# Altium schematic sheet Sitara_Power.SchDoc
size A3; SheetNumber: 4; SheetTotal: 10
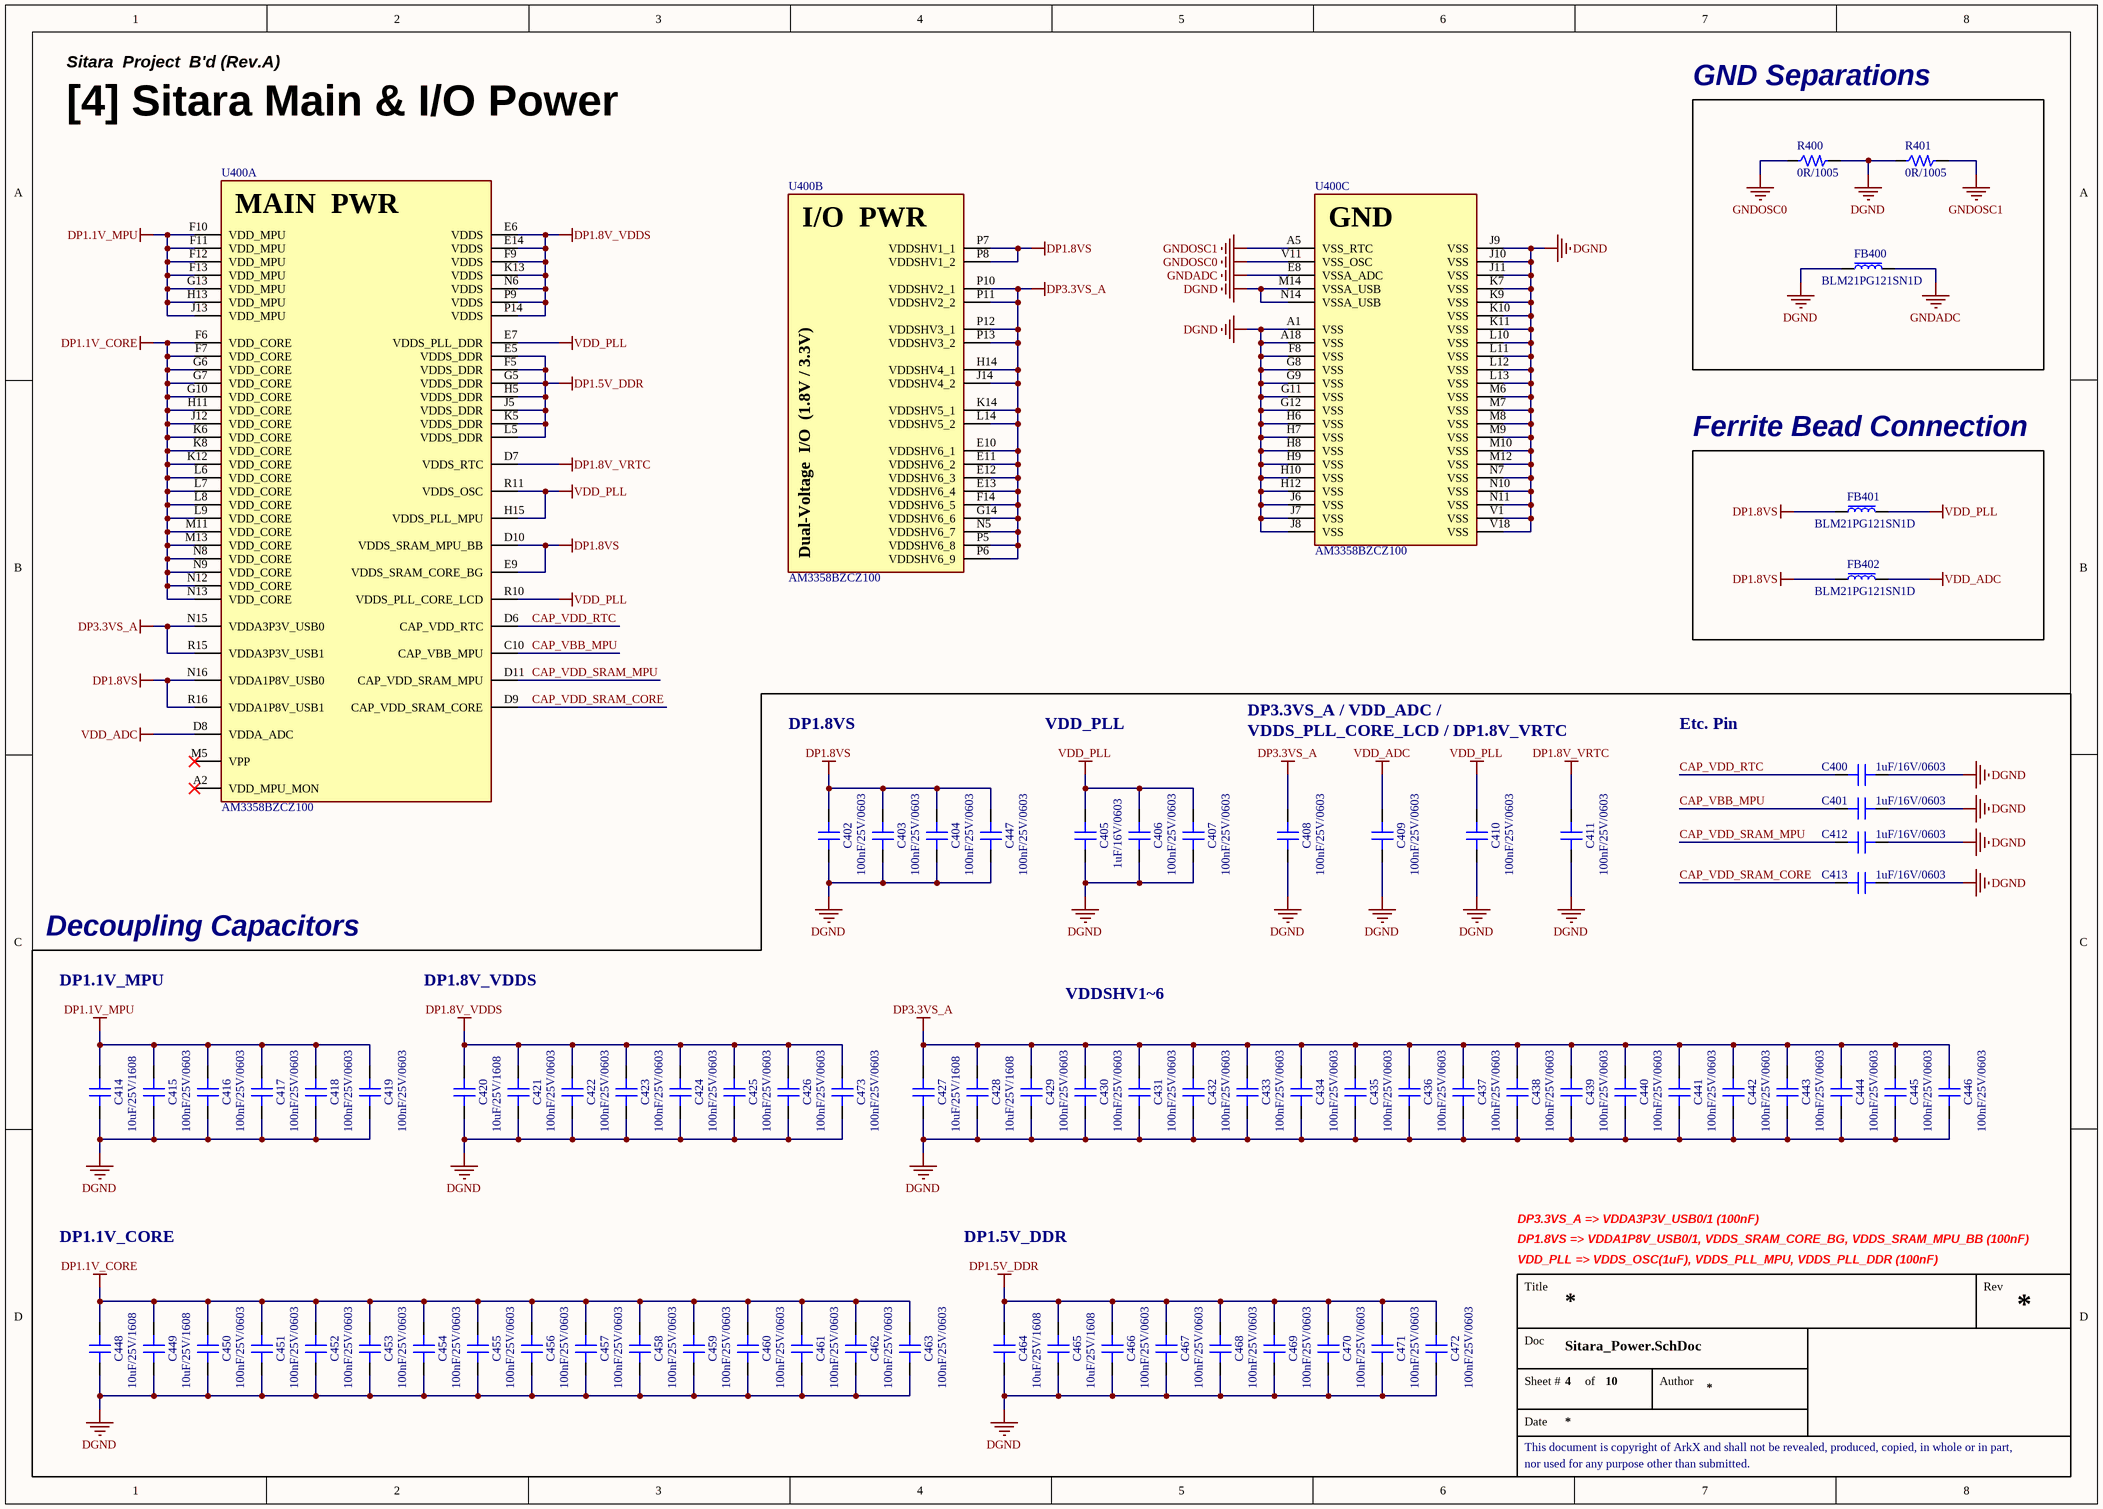
[diagram p0: Sitara_Power.SchDoc]

## Parts
C400  1uF/16V/0603  [CAP 0603 (0201_INCH)]
C401  1uF/16V/0603  [CAP 0603 (0201_INCH)]
C402  100nF/25V/0603  [CAP 0603 (0201_INCH)]
C403  100nF/25V/0603  [CAP 0603 (0201_INCH)]
C404  100nF/25V/0603  [CAP 0603 (0201_INCH)]
C405  1uF/16V/0603  [CAP 0603 (0201_INCH)]
C406  100nF/25V/0603  [CAP 0603 (0201_INCH)]
C407  100nF/25V/0603  [CAP 0603 (0201_INCH)]
C408  100nF/25V/0603  [CAP 0603 (0201_INCH)]
C409  100nF/25V/0603  [CAP 0603 (0201_INCH)]
C410  100nF/25V/0603  [CAP 0603 (0201_INCH)]
C411  100nF/25V/0603  [CAP 0603 (0201_INCH)]
C412  1uF/16V/0603  [CAP 0603 (0201_INCH)]
C413  1uF/16V/0603  [CAP 0603 (0201_INCH)]
C414  10uF/25V/1608  [CAP 1608 (0603_INCH)]
C415  100nF/25V/0603  [CAP 0603 (0201_INCH)]
C416  100nF/25V/0603  [CAP 0603 (0201_INCH)]
C417  100nF/25V/0603  [CAP 0603 (0201_INCH)]
C418  100nF/25V/0603  [CAP 0603 (0201_INCH)]
C419  100nF/25V/0603  [CAP 0603 (0201_INCH)]
C420  10uF/25V/1608  [CAP 1608 (0603_INCH)]
C421  100nF/25V/0603  [CAP 0603 (0201_INCH)]
C422  100nF/25V/0603  [CAP 0603 (0201_INCH)]
C423  100nF/25V/0603  [CAP 0603 (0201_INCH)]
C424  100nF/25V/0603  [CAP 0603 (0201_INCH)]
C425  100nF/25V/0603  [CAP 0603 (0201_INCH)]
C426  100nF/25V/0603  [CAP 0603 (0201_INCH)]
C427  10uF/25V/1608  [CAP 1608 (0603_INCH)]
C428  10uF/25V/1608  [CAP 1608 (0603_INCH)]
C429  100nF/25V/0603  [CAP 0603 (0201_INCH)]
C430  100nF/25V/0603  [CAP 0603 (0201_INCH)]
C431  100nF/25V/0603  [CAP 0603 (0201_INCH)]
C432  100nF/25V/0603  [CAP 0603 (0201_INCH)]
C433  100nF/25V/0603  [CAP 0603 (0201_INCH)]
C434  100nF/25V/0603  [CAP 0603 (0201_INCH)]
C435  100nF/25V/0603  [CAP 0603 (0201_INCH)]
C436  100nF/25V/0603  [CAP 0603 (0201_INCH)]
C437  100nF/25V/0603  [CAP 0603 (0201_INCH)]
C438  100nF/25V/0603  [CAP 0603 (0201_INCH)]
C439  100nF/25V/0603  [CAP 0603 (0201_INCH)]
C440  100nF/25V/0603  [CAP 0603 (0201_INCH)]
C441  100nF/25V/0603  [CAP 0603 (0201_INCH)]
C442  100nF/25V/0603  [CAP 0603 (0201_INCH)]
C443  100nF/25V/0603  [CAP 0603 (0201_INCH)]
C444  100nF/25V/0603  [CAP 0603 (0201_INCH)]
C445  100nF/25V/0603  [CAP 0603 (0201_INCH)]
C446  100nF/25V/0603  [CAP 0603 (0201_INCH)]
C447  100nF/25V/0603  [CAP 0603 (0201_INCH)]
C448  10uF/25V/1608  [CAP 1608 (0603_INCH)]
C449  10uF/25V/1608  [CAP 1608 (0603_INCH)]
C450  100nF/25V/0603  [CAP 0603 (0201_INCH)]
C451  100nF/25V/0603  [CAP 0603 (0201_INCH)]
C452  100nF/25V/0603  [CAP 0603 (0201_INCH)]
C453  100nF/25V/0603  [CAP 0603 (0201_INCH)]
C454  100nF/25V/0603  [CAP 0603 (0201_INCH)]
C455  100nF/25V/0603  [CAP 0603 (0201_INCH)]
C456  100nF/25V/0603  [CAP 0603 (0201_INCH)]
C457  100nF/25V/0603  [CAP 0603 (0201_INCH)]
C458  100nF/25V/0603  [CAP 0603 (0201_INCH)]
C459  100nF/25V/0603  [CAP 0603 (0201_INCH)]
C460  100nF/25V/0603  [CAP 0603 (0201_INCH)]
C461  100nF/25V/0603  [CAP 0603 (0201_INCH)]
C462  100nF/25V/0603  [CAP 0603 (0201_INCH)]
C463  100nF/25V/0603  [CAP 0603 (0201_INCH)]
C464  10uF/25V/1608  [CAP 1608 (0603_INCH)]
C465  10uF/25V/1608  [CAP 1608 (0603_INCH)]
C466  100nF/25V/0603  [CAP 0603 (0201_INCH)]
C467  100nF/25V/0603  [CAP 0603 (0201_INCH)]
C468  100nF/25V/0603  [CAP 0603 (0201_INCH)]
C469  100nF/25V/0603  [CAP 0603 (0201_INCH)]
C470  100nF/25V/0603  [CAP 0603 (0201_INCH)]
C471  100nF/25V/0603  [CAP 0603 (0201_INCH)]
C472  100nF/25V/0603  [CAP 0603 (0201_INCH)]
C473  100nF/25V/0603  [CAP 0603 (0201_INCH)]
FB400  BLM21PG121SN1D  [FB 2012 (0805_inch)]
FB401  BLM21PG121SN1D  [FB 2012 (0805_inch)]
FB402  BLM21PG121SN1D  [FB 2012 (0805_inch)]
R400  0R/1005  [RES 1005 (0402_inch)]
R401  0R/1005  [RES 1005 (0402_inch)]
U400  AM3358BZCZ100  [IC_SOC_AM3358BZCZ100]  (parts A,B,C of 8)

## Blocks framed on the sheet
GND Separations: FB400 R400 R401
Ferrite Bead Connection: FB401 FB402

## Nets
DGND: C400.2 C401.2 C402.1 C403.1 C404.1 C405.1 C406.1 C407.1 C408.1 C409.1 C410.1 C411.1 C412.2 C413.2 C414.1 C415.1 C416.1 C417.1 C418.1 C419.1 C420.1 C421.1 C422.1 C423.1 C424.1 C425.1 C426.1 C427.1 C428.1 C429.1 C430.1 C431.1 C432.1 C433.1 C434.1 C435.1 C436.1 C437.1 C438.1 C439.1 C440.1 C441.1 C442.1 C443.1 C444.1 C445.1 C446.1 C447.1 C448.1 C449.1 C450.1 C451.1 C452.1 C453.1 C454.1 C455.1 C456.1 C457.1 C458.1 C459.1 C460.1 C461.1 C462.1 C463.1 C464.1 C465.1 C466.1 C467.1 C468.1 C469.1 C470.1 C471.1 C472.1 C473.1 FB400.1 R400.2 R401.1 U400.A1(VSS) U400.A18(VSS) U400.F8(VSS) U400.G8(VSS) U400.G9(VSS) U400.G11(VSS) U400.G12(VSS) U400.H6(VSS) U400.H7(VSS) U400.H8(VSS) U400.H9(VSS) U400.H10(VSS) U400.H12(VSS) U400.J6(VSS) U400.J7(VSS) U400.J8(VSS) U400.J9(VSS) U400.J10(VSS) U400.J11(VSS) U400.K7(VSS) U400.K9(VSS) U400.K10(VSS) U400.K11(VSS) U400.L10(VSS) U400.L11(VSS) U400.L12(VSS) U400.L13(VSS) U400.M6(VSS) U400.M7(VSS) U400.M8(VSS) U400.M9(VSS) U400.M10(VSS) U400.M12(VSS) U400.M14(VSSA_USB) U400.N7(VSS) U400.N10(VSS) U400.N11(VSS) U400.N14(VSSA_USB) U400.V1(VSS) U400.V18(VSS)
DP1.1V_CORE: C448.2 C449.2 C450.2 C451.2 C452.2 C453.2 C454.2 C455.2 C456.2 C457.2 C458.2 C459.2 C460.2 C461.2 C462.2 C463.2 U400.F6(VDD_CORE) U400.F7(VDD_CORE) U400.G6(VDD_CORE) U400.G7(VDD_CORE) U400.G10(VDD_CORE) U400.H11(VDD_CORE) U400.J12(VDD_CORE) U400.K6(VDD_CORE) U400.K8(VDD_CORE) U400.K12(VDD_CORE) U400.L6(VDD_CORE) U400.L7(VDD_CORE) U400.L8(VDD_CORE) U400.L9(VDD_CORE) U400.M11(VDD_CORE) U400.M13(VDD_CORE) U400.N8(VDD_CORE) U400.N9(VDD_CORE) U400.N12(VDD_CORE) U400.N13(VDD_CORE)
DP1.1V_MPU: C414.2 C415.2 C416.2 C417.2 C418.2 C419.2 U400.F10(VDD_MPU) U400.F11(VDD_MPU) U400.F12(VDD_MPU) U400.F13(VDD_MPU) U400.G13(VDD_MPU) U400.H13(VDD_MPU) U400.J13(VDD_MPU)
DP1.5V_DDR: C464.2 C465.2 C466.2 C467.2 C468.2 C469.2 C470.2 C471.2 C472.2 U400.E5(VDDS_DDR) U400.F5(VDDS_DDR) U400.G5(VDDS_DDR) U400.H5(VDDS_DDR) U400.J5(VDDS_DDR) U400.K5(VDDS_DDR) U400.L5(VDDS_DDR)
DP1.8V_VDDS: C420.2 C421.2 C422.2 C423.2 C424.2 C425.2 C426.2 C473.2 U400.E6(VDDS) U400.E14(VDDS) U400.F9(VDDS) U400.K13(VDDS) U400.N6(VDDS) U400.P9(VDDS) U400.P14(VDDS)
DP1.8V_VRTC: C411.2 U400.D7(VDDS_RTC)
DP1.8VS: C402.2 C403.2 C404.2 C447.2 FB401.1 FB402.1 U400.D10(VDDS_SRAM_MPU_BB) U400.E9(VDDS_SRAM_CORE_BG) U400.N16(VDDA1P8V_USB0) U400.P7(VDDSHV1_1) U400.P8(VDDSHV1_2) U400.R16(VDDA1P8V_USB1)
DP3.3VS_A: C408.2 C427.2 C428.2 C429.2 C430.2 C431.2 C432.2 C433.2 C434.2 C435.2 C436.2 C437.2 C438.2 C439.2 C440.2 C441.2 C442.2 C443.2 C444.2 C445.2 C446.2 U400.E10(VDDSHV6_1) U400.E11(VDDSHV6_2) U400.E12(VDDSHV6_3) U400.E13(VDDSHV6_4) U400.F14(VDDSHV6_5) U400.G14(VDDSHV6_6) U400.H14(VDDSHV4_1) U400.J14(VDDSHV4_2) U400.K14(VDDSHV5_1) U400.L14(VDDSHV5_2) U400.N5(VDDSHV6_7) U400.N15(VDDA3P3V_USB0) U400.P5(VDDSHV6_8) U400.P6(VDDSHV6_9) U400.P10(VDDSHV2_1) U400.P11(VDDSHV2_2) U400.P12(VDDSHV3_1) U400.P13(VDDSHV3_2) U400.R15(VDDA3P3V_USB1)
GNDADC: FB400.2 U400.E8(VSSA_ADC)
GNDOSC0: R400.1 U400.V11(VSS_OSC)
GNDOSC1: R401.2 U400.A5(VSS_RTC)
VDD_ADC: C409.2 FB402.2 U400.D8(VDDA_ADC)
VDD_PLL: C405.2 C406.2 C407.2 C410.2 FB401.2 U400.E7(VDDS_PLL_DDR) U400.H15(VDDS_PLL_MPU) U400.R10(VDDS_PLL_CORE_LCD) U400.R11(VDDS_OSC)
CAP_VBB_MPU: C401.1 U400.C10(CAP_VBB_MPU)
CAP_VDD_RTC: C400.1 U400.D6(CAP_VDD_RTC)
CAP_VDD_SRAM_CORE: C413.1 U400.D9(CAP_VDD_SRAM_CORE)
CAP_VDD_SRAM_MPU: C412.1 U400.D11(CAP_VDD_SRAM_MPU)

Not connected (* = marked no-connect by the designer): U400 A2(VDD_MPU_MON)* M5(VPP)*

## Notes on the sheet
- Sitara  Project  B'd (Rev.A)
- [4] Sitara Main & I/O Power
- DP3.3VS_A / VDD_ADC /
- DP1.8VS
- VDD_PLL
- VDDS_PLL_CORE_LCD / DP1.8V_VRTC
- Etc. Pin
- Decoupling Capacitors
- DP1.1V_MPU
- DP1.8V_VDDS
- VDDSHV1~6
- DP1.1V_CORE
- DP1.5V_DDR
- DP3.3VS_A => VDDA3P3V_USB0/1 (100nF)
- DP1.8VS => VDDA1P8V_USB0/1, VDDS_SRAM_CORE_BG, VDDS_SRAM_MPU_BB (100nF)
- VDD_PLL => VDDS_OSC(1uF), VDDS_PLL_MPU, VDDS_PLL_DDR (100nF)
- Title
- Rev
- Doc
- Sheet #
- of
- Author
- This document is copyright of ArkX and shall not be revealed, produced, copied, in whole or in part,
- Date
- nor used for any purpose other than submitted.
- (in symbol IC_SOC_AM3358BZCZ100, part A) MAIN  PWR
- (in symbol IC_SOC_AM3358BZCZ100, part B) I/O  PWR; Dual-Voltage  I/O  (1.8V / 3.3V)
- (in symbol IC_SOC_AM3358BZCZ100, part C) GND

## Library data of the parts
C400 C401 C405 C412 C413 = CAP_1uF/16V/0603: Ceramic CAP_1uF/16V/0603; JLCPCB Part Type: Extended Part; LCSC Part #: C307385
C402-C404 C406-C411 C415-C419 C421-C426 C429-C447 C450-C463 C466-C473 = CAP_100nF/25V/0603: Ceramic CAP_100nF/25V/0603; JLCPCB Part Type: Extended Part; LCSC Part #: C181047
C414 C420 C427 C428 C448 C449 C464 C465 = CAP_10uF/25V/1608: Ceramic CAP_10uF/25V/1608; LCSC Part #: C96446; JLCPCB Part Type: Basic Part
FB400-FB402 = FB_BLM21PG121SN1D: 3A 1 30mΩ 120Ω@100MHz ±25% 0805  Ferrite Beads ROHS; LCSC Part #: C79382; JLCPCB Part Type: Extended Part
R400 R401 = RES_0R/1005/62.5mW: Value: 0R; Power Rating: 62.5mW; Precision: 1%; Size: 1005; LCSC Part #: C17168; JLCPCB Part Type: Basic Part
U400 = IC_SOC_AM3358BZCZ100: ARM® Cortex®-A8 Microprocessor IC Sitara™ 1 Core, 32-Bit 1.0GHz 324-NFBGA (15x15); LCSC Part #: C73932; JLCPCB Part Type: Extended Part